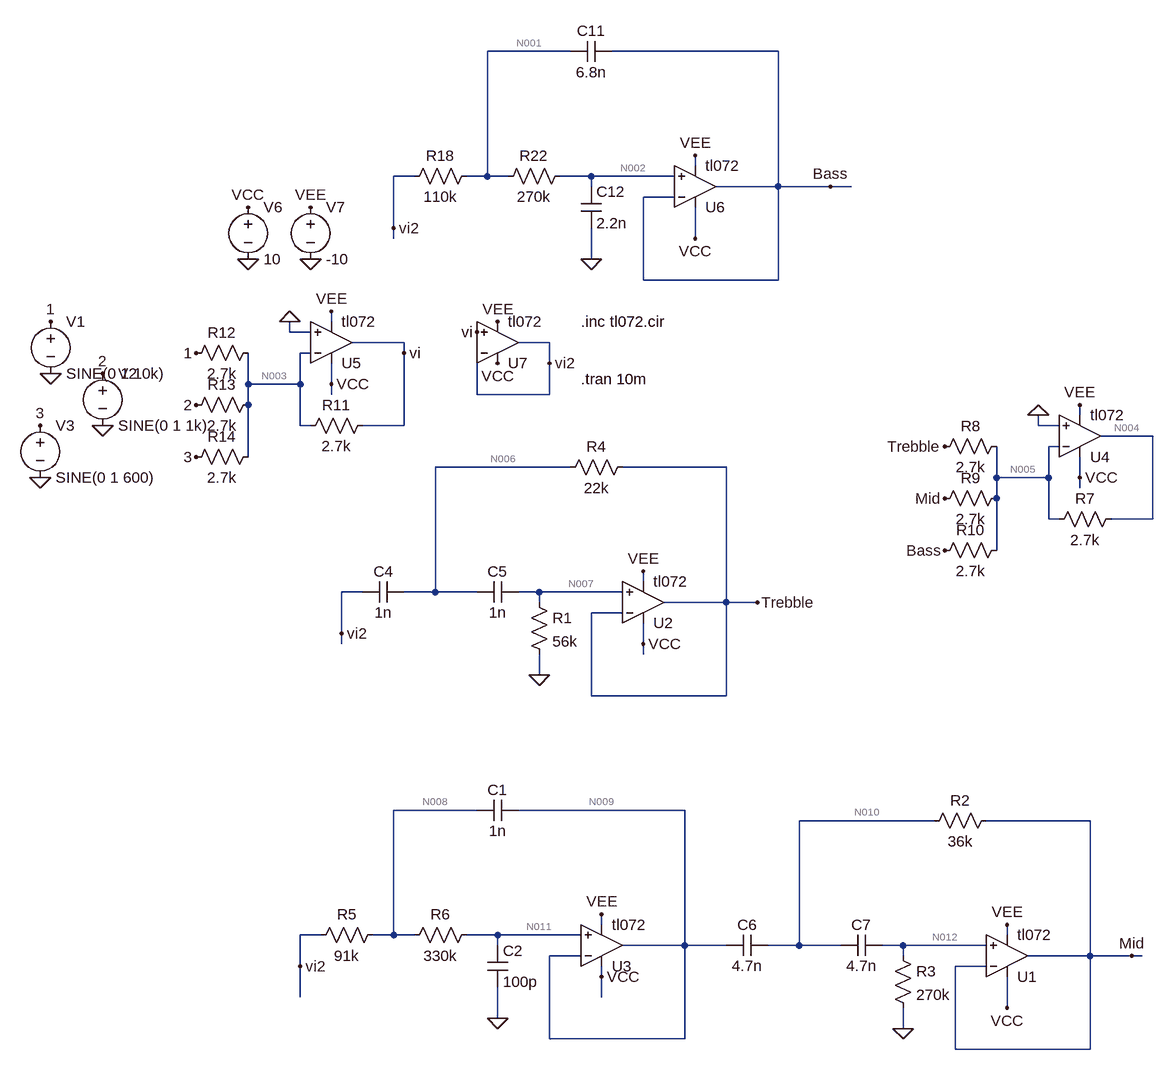
[diagram p0: schematic EQreal.asc]
EQreal.asc, the LTspice schematic file:
Version 4.1
SHEET 1 4040 1008
WIRE 80 -768 -48 -768
WIRE 400 -768 144 -768
WIRE 272 -592 272 -608
WIRE -160 -576 -192 -576
WIRE -48 -576 -48 -768
WIRE -48 -576 -80 -576
WIRE -16 -576 -48 -576
WIRE 112 -576 64 -576
WIRE 240 -576 112 -576
WIRE 112 -560 112 -576
WIRE 400 -560 400 -768
WIRE 400 -560 304 -560
WIRE 480 -560 400 -560
WIRE 512 -560 480 -560
WIRE 240 -544 192 -544
WIRE -192 -496 -192 -576
WIRE -192 -480 -192 -496
WIRE 272 -480 272 -528
WIRE 112 -448 112 -496
WIRE 192 -416 192 -544
WIRE 400 -416 400 -560
WIRE 400 -416 192 -416
WIRE -288 -352 -288 -368
WIRE -352 -336 -352 -352
WIRE -320 -336 -352 -336
WIRE -176 -320 -256 -320
WIRE 48 -320 0 -320
WIRE -320 -304 -336 -304
WIRE -176 -304 -176 -320
WIRE 48 -288 48 -320
WIRE -416 -256 -416 -304
WIRE -336 -256 -336 -304
WIRE -336 -256 -416 -256
WIRE -288 -256 -288 -288
WIRE -288 -240 -288 -256
WIRE -64 -240 -64 -304
WIRE 48 -240 48 -288
WIRE 48 -240 -64 -240
WIRE -416 -224 -416 -256
WIRE 864 -208 864 -224
WIRE -336 -192 -336 -256
WIRE -320 -192 -336 -192
WIRE -176 -192 -176 -304
WIRE -176 -192 -240 -192
WIRE 800 -192 800 -208
WIRE 832 -192 800 -192
WIRE 976 -176 896 -176
WIRE 832 -160 816 -160
WIRE -416 -144 -416 -224
WIRE 80 -128 -128 -128
WIRE 320 -128 160 -128
WIRE 736 -112 736 -160
WIRE 816 -112 816 -160
WIRE 816 -112 736 -112
WIRE 864 -112 864 -144
WIRE 864 -96 864 -112
WIRE 736 -80 736 -112
WIRE 816 -48 816 -112
WIRE 832 -48 816 -48
WIRE 976 -48 976 -176
WIRE 976 -48 912 -48
WIRE 736 0 736 -80
WIRE 192 48 192 32
WIRE -240 64 -272 64
WIRE -128 64 -128 -128
WIRE -128 64 -176 64
WIRE -64 64 -128 64
WIRE 32 64 0 64
WIRE 160 64 32 64
WIRE 32 80 32 64
WIRE 320 80 320 -128
WIRE 320 80 224 80
WIRE 368 80 320 80
WIRE 160 96 112 96
WIRE -272 128 -272 64
WIRE -272 144 -272 128
WIRE 192 144 192 112
WIRE 192 160 192 144
WIRE 32 192 32 160
WIRE 112 224 112 96
WIRE 320 224 320 80
WIRE 320 224 112 224
WIRE -64 400 -192 400
WIRE 256 400 0 400
WIRE 640 416 432 416
WIRE 880 416 720 416
WIRE 128 576 128 560
WIRE -304 592 -336 592
WIRE -192 592 -192 400
WIRE -192 592 -224 592
WIRE -160 592 -192 592
WIRE -32 592 -80 592
WIRE 96 592 -32 592
WIRE 752 592 752 576
WIRE -32 608 -32 592
WIRE 256 608 256 400
WIRE 256 608 160 608
WIRE 320 608 256 608
WIRE 432 608 432 416
WIRE 432 608 384 608
WIRE 496 608 432 608
WIRE 592 608 560 608
WIRE 720 608 592 608
WIRE 96 624 48 624
WIRE 592 624 592 608
WIRE 880 624 880 416
WIRE 880 624 784 624
WIRE 944 624 880 624
WIRE 960 624 944 624
WIRE -336 640 -336 592
WIRE 720 640 672 640
WIRE 128 656 128 640
WIRE -336 688 -336 640
WIRE 128 688 128 656
WIRE 752 704 752 656
WIRE -32 720 -32 672
WIRE 592 736 592 704
WIRE 48 752 48 624
WIRE 256 752 256 608
WIRE 256 752 48 752
WIRE 672 768 672 640
WIRE 880 768 880 624
WIRE 880 768 672 768
FLAG 32 192 0
FLAG 112 -448 0
FLAG -416 -448 0
FLAG -320 -448 0
FLAG -416 -528 VCC
FLAG -320 -528 VEE
FLAG 592 736 0
FLAG -32 720 0
FLAG 272 -608 VEE
FLAG 272 -480 VCC
FLAG 192 32 VEE
FLAG 192 144 VCC
FLAG 128 656 VCC
FLAG 752 704 VCC
FLAG 128 560 VEE
FLAG 864 -224 VEE
FLAG 864 -112 VCC
FLAG 656 -160 Trebble
FLAG 656 -80 Mid
FLAG 656 0 Bass
FLAG 752 576 VEE
FLAG 800 -208 0
FLAG 944 624 Mid
FLAG 480 -560 Bass
FLAG 368 80 Trebble
FLAG -720 -272 0
FLAG -640 -192 0
FLAG -288 -368 VEE
FLAG -288 -256 VCC
FLAG -352 -352 0
FLAG -736 -112 0
FLAG -720 -352 1
FLAG -496 -304 1
FLAG -496 -224 2
FLAG -640 -272 2
FLAG -496 -144 3
FLAG -736 -192 3
FLAG -176 -304 vi
FLAG -32 -288 VCC
FLAG -32 -352 VEE
FLAG -64 -336 vi
FLAG 48 -288 vi2
FLAG -192 -496 vi2
FLAG -272 128 vi2
FLAG -336 640 vi2
DATAFLAG 304 80 ""
SYMBOL OpAmps\\opamp2 192 144 M180
SYMATTR InstName U2
SYMATTR Value tl072
SYMBOL res 176 -144 R90
WINDOW 0 0 56 VBottom 2
WINDOW 3 32 56 VTop 2
SYMATTR InstName R4
SYMATTR Value 22k
SYMBOL cap -176 48 R90
WINDOW 0 0 32 VBottom 2
WINDOW 3 32 32 VTop 2
SYMATTR InstName C4
SYMATTR Value 1n
SYMBOL cap 0 48 R90
WINDOW 0 0 32 VBottom 2
WINDOW 3 32 32 VTop 2
SYMATTR InstName C5
SYMATTR Value 1n
SYMBOL res 16 64 R0
SYMATTR InstName R1
SYMATTR Value 56k
SYMBOL voltage -416 -544 R0
WINDOW 123 0 0 Left 0
WINDOW 39 0 0 Left 0
SYMATTR InstName V6
SYMATTR Value 10
SYMBOL voltage -320 -544 R0
WINDOW 123 0 0 Left 0
WINDOW 39 0 0 Left 0
SYMATTR InstName V7
SYMATTR Value -10
SYMBOL OpAmps\\opamp2 272 -496 M180
SYMATTR InstName U6
SYMATTR Value tl072
SYMBOL res -64 -592 R90
WINDOW 0 0 56 VBottom 2
WINDOW 3 32 56 VTop 2
SYMATTR InstName R18
SYMATTR Value 110k
SYMBOL res 80 -592 R90
WINDOW 0 0 56 VBottom 2
WINDOW 3 32 56 VTop 2
SYMATTR InstName R22
SYMATTR Value 270k
SYMBOL cap 144 -784 R90
WINDOW 0 0 32 VBottom 2
WINDOW 3 32 32 VTop 2
SYMATTR InstName C11
SYMATTR Value 6.8n
SYMBOL cap 96 -560 R0
SYMATTR InstName C12
SYMATTR Value 2.2n
SYMBOL OpAmps\\opamp2 752 688 M180
SYMATTR InstName U1
SYMATTR Value tl072
SYMBOL res 736 400 R90
WINDOW 0 0 56 VBottom 2
WINDOW 3 32 56 VTop 2
SYMATTR InstName R2
SYMATTR Value 36k
SYMBOL cap 384 592 R90
WINDOW 0 0 32 VBottom 2
WINDOW 3 32 32 VTop 2
SYMATTR InstName C6
SYMATTR Value 4.7n
SYMBOL cap 560 592 R90
WINDOW 0 0 32 VBottom 2
WINDOW 3 32 32 VTop 2
SYMATTR InstName C7
SYMATTR Value 4.7n
SYMBOL res 576 608 R0
SYMATTR InstName R3
SYMATTR Value 270k
SYMBOL OpAmps\\opamp2 128 672 M180
SYMATTR InstName U3
SYMATTR Value tl072
SYMBOL res -208 576 R90
WINDOW 0 0 56 VBottom 2
WINDOW 3 32 56 VTop 2
SYMATTR InstName R5
SYMATTR Value 91k
SYMBOL res -64 576 R90
WINDOW 0 0 56 VBottom 2
WINDOW 3 32 56 VTop 2
SYMATTR InstName R6
SYMATTR Value 330k
SYMBOL cap 0 384 R90
WINDOW 0 0 32 VBottom 2
WINDOW 3 32 32 VTop 2
SYMATTR InstName C1
SYMATTR Value 1n
SYMBOL cap -48 608 R0
SYMATTR InstName C2
SYMATTR Value 100p
SYMBOL OpAmps\\opamp2 864 -112 M180
SYMATTR InstName U4
SYMATTR Value tl072
SYMBOL res 928 -64 R90
WINDOW 0 0 56 VBottom 2
WINDOW 3 32 56 VTop 2
SYMATTR InstName R7
SYMATTR Value 2.7k
SYMBOL res 752 -176 R90
WINDOW 0 0 56 VBottom 2
WINDOW 3 32 56 VTop 2
SYMATTR InstName R8
SYMATTR Value 2.7k
SYMBOL res 752 -96 R90
WINDOW 0 0 56 VBottom 2
WINDOW 3 32 56 VTop 2
SYMATTR InstName R9
SYMATTR Value 2.7k
SYMBOL res 752 -16 R90
WINDOW 0 0 56 VBottom 2
WINDOW 3 32 56 VTop 2
SYMATTR InstName R10
SYMATTR Value 2.7k
SYMBOL voltage -720 -368 R0
WINDOW 123 0 0 Left 0
WINDOW 39 0 0 Left 0
SYMATTR InstName V1
SYMATTR Value SINE(0 1 10k)
SYMBOL voltage -640 -288 R0
WINDOW 123 0 0 Left 0
WINDOW 39 0 0 Left 0
SYMATTR InstName V2
SYMATTR Value SINE(0 1 1k)
SYMBOL OpAmps\\opamp2 -288 -256 M180
SYMATTR InstName U5
SYMATTR Value tl072
SYMBOL res -224 -208 R90
WINDOW 0 0 56 VBottom 2
WINDOW 3 32 56 VTop 2
SYMATTR InstName R11
SYMATTR Value 2.7k
SYMBOL res -400 -320 R90
WINDOW 0 0 56 VBottom 2
WINDOW 3 32 56 VTop 2
SYMATTR InstName R12
SYMATTR Value 2.7k
SYMBOL res -400 -240 R90
WINDOW 0 0 56 VBottom 2
WINDOW 3 32 56 VTop 2
SYMATTR InstName R13
SYMATTR Value 2.7k
SYMBOL res -400 -160 R90
WINDOW 0 0 56 VBottom 2
WINDOW 3 32 56 VTop 2
SYMATTR InstName R14
SYMATTR Value 2.7k
SYMBOL voltage -736 -208 R0
WINDOW 123 0 0 Left 0
WINDOW 39 0 0 Left 0
SYMATTR InstName V3
SYMATTR Value SINE(0 1 600)
SYMBOL OpAmps\\opamp2 -32 -256 M180
SYMATTR InstName U7
SYMATTR Value tl072
TEXT 96 -352 Left 2 !.inc tl072.cir
TEXT 96 -264 Left 2 !.tran 10m

The netlist it stands for:
* EQreal.asc
X§U2 N007 Trebble VCC VEE Trebble tl072  ; pins In+ In- V+ V- OUT
R4 Trebble N006 22k
C4 N006 vi2 1n
C5 N007 N006 1n
R1 N007 0 56k
V6 VCC 0 10
V7 VEE 0 -10
X§U6 N002 Bass VCC VEE Bass tl072  ; pins In+ In- V+ V- OUT
R18 N001 vi2 110k
R22 N002 N001 270k
C11 Bass N001 6.8n
C12 N002 0 2.2n
X§U1 N012 Mid VCC VEE Mid tl072  ; pins In+ In- V+ V- OUT
R2 Mid N010 36k
C6 N010 N009 4.7n
C7 N012 N010 4.7n
R3 N012 0 270k
X§U3 N011 N009 VCC VEE N009 tl072  ; pins In+ In- V+ V- OUT
R5 N008 vi2 91k
R6 N011 N008 330k
C1 N009 N008 1n
C2 N011 0 100p
X§U4 0 N005 VCC VEE N004 tl072  ; pins In+ In- V+ V- OUT
R7 N004 N005 2.7k
R8 N005 Trebble 2.7k
R9 N005 Mid 2.7k
R10 N005 Bass 2.7k
V1 1 0 SINE(0 1 10k)
V2 2 0 SINE(0 1 1k)
X§U5 0 N003 VCC VEE vi tl072  ; pins In+ In- V+ V- OUT
R11 vi N003 2.7k
R12 N003 1 2.7k
R13 N003 2 2.7k
R14 N003 3 2.7k
V3 3 0 SINE(0 1 600)
X§U7 vi vi2 VCC VEE vi2 tl072  ; pins In+ In- V+ V- OUT
.inc tl072.cir
.tran 10m
.backanno
.end

* Results of the author's LTspice run, read from the files saved beside the schematic
* Operating Point, zero values left out:
*   V(bass) = 50.71 µV
*   V(mid) = 156.7 nV
*   V(n001) = 50.55 µV
*   V(n002) = 39.74 µV
*   V(n003) = 10.97 µV
*   V(n004) = -15.6 µV
*   V(n005) = 10.97 µV
*   V(n006) = 8.728 µV
*   V(n007) = -2.243 µV
*   V(n008) = 51.31 µV
*   V(n009) = 49.07 µV
*   V(n010) = 156.7 nV
*   V(n011) = 38.1 µV
*   V(n012) = -10.81 µV
*   V(trebble) = 8.728 µV
*   V(vcc) = 10 V
*   V(vee) = -10 V
*   V(vi) = 43.99 µV
*   V(vi2) = 54.96 µV
*   I(R1) = -40.05 pA
*   I(R10) = -14.72 nA
*   I(R11) = 12.23 nA
*   I(R12) = 4.063 nA
*   I(R13) = 4.063 nA
*   I(R14) = 4.063 nA
*   I(R18) = -40.05 pA
*   I(R22) = -40.05 pA
*   I(R3) = -40.05 pA
*   I(R5) = -40.05 pA
*   I(R6) = -40.05 pA
*   I(R7) = -9.842 nA
*   I(R8) = 830.8 pA
*   I(R9) = 4.005 nA
*   I(V1) = 4.063 nA
*   I(V2) = 4.063 nA
*   I(V3) = 4.063 nA
*   I(V6) = -66.69 mA
*   I(V7) = 66.7 mA
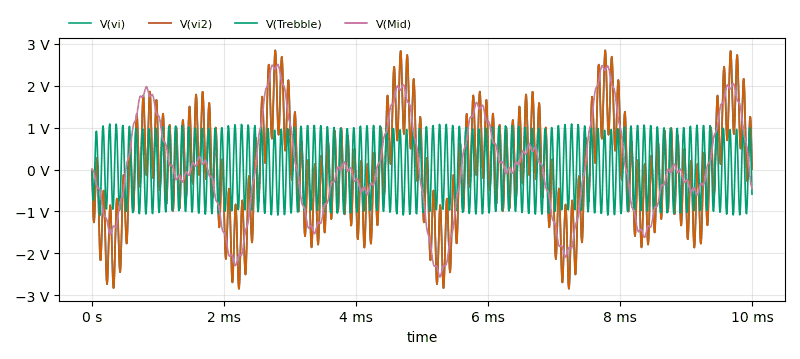
[diagram p1: Transient Analysis of EQreal.asc, plotted from the saved traces]
* Transient Analysis, 1 run:
*   V(vi): min -2.848 V, max 2.847 V, average 9.183 µV, rms 1.226 V, last 14.16 mV
*   V(vi2): min -2.848 V, max 2.847 V, average 20 µV, rms 1.226 V, last 17.55 mV
*   V(Trebble): min -1.097 V, max 1.088 V, average 132.3 µV, rms 722.1 mV, last -587 mV
*   V(Mid): min -2.566 V, max 2.512 V, average 50.62 mV, rms 1.218 V, last -455.3 mV